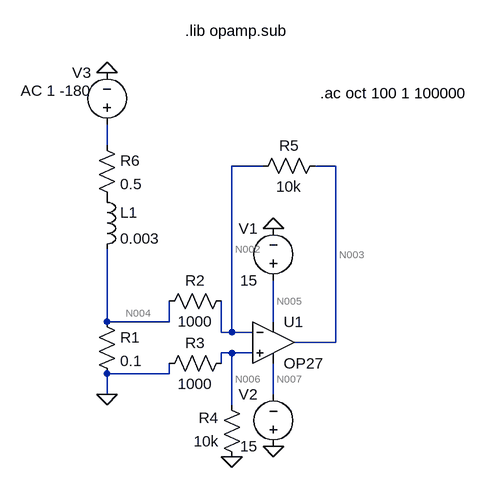
[diagram p0: schematic test_coil_bodecorrel.asc]
test_coil_bodecorrel.asc, the LTspice schematic file:
Version 4
SHEET 1 880 680
WIRE 128 -64 128 -96
WIRE 368 -32 320 -32
WIRE 480 -32 448 -32
WIRE 128 208 128 96
WIRE 224 208 224 176
WIRE 224 208 128 208
WIRE 384 208 384 144
WIRE 304 224 304 176
WIRE 320 224 320 -32
WIRE 320 224 304 224
WIRE 352 224 320 224
WIRE 480 240 480 -32
WIRE 480 240 416 240
WIRE 320 256 304 256
WIRE 352 256 320 256
WIRE 304 272 304 256
WIRE 224 288 224 272
WIRE 224 288 128 288
WIRE 128 320 128 288
WIRE 384 320 384 272
WIRE 320 336 320 256
FLAG 320 416 0
FLAG 128 320 0
FLAG 384 400 0
FLAG 384 64 0
FLAG 128 -176 0
SYMBOL OpAmps\\OP27 384 176 R0
SYMATTR InstName U1
SYMBOL res 112 192 R0
SYMATTR InstName R1
SYMATTR Value 0.1
SYMBOL res 320 160 R90
WINDOW 0 0 56 VBottom 2
WINDOW 3 32 56 VTop 2
SYMATTR InstName R2
SYMATTR Value 1000
SYMBOL res 320 256 R90
WINDOW 0 0 56 VBottom 2
WINDOW 3 32 56 VTop 2
SYMATTR InstName R3
SYMATTR Value 1000
SYMBOL res 336 432 R180
WINDOW 0 36 76 Left 2
WINDOW 3 36 40 Left 2
SYMATTR InstName R4
SYMATTR Value 10k
SYMBOL res 352 -16 R270
WINDOW 0 32 56 VTop 2
WINDOW 3 0 56 VBottom 2
SYMATTR InstName R5
SYMATTR Value 10k
SYMBOL voltage 384 160 R180
WINDOW 0 24 96 Left 2
WINDOW 3 24 16 Left 2
SYMATTR InstName V1
SYMATTR Value 15
SYMBOL voltage 384 416 R180
WINDOW 0 24 96 Left 2
WINDOW 3 24 16 Left 2
SYMATTR InstName V2
SYMATTR Value 15
SYMBOL ind 112 0 R0
SYMATTR InstName L1
SYMATTR Value 0.003
SYMBOL res 112 -80 R0
SYMATTR InstName R6
SYMATTR Value 0.5
SYMBOL voltage 128 -80 R180
WINDOW 0 24 96 Left 2
WINDOW 3 24 16 Left 2
WINDOW 123 24 68 Left 2
WINDOW 39 0 0 Left 0
SYMATTR InstName V3
SYMATTR Value ""
SYMATTR Value2 AC 1 -180
TEXT 248 -240 Left 2 !.lib opamp.sub
TEXT 456 -144 Left 2 !.ac oct 100 1 100000

The netlist it stands for:
* test_coil_bodecorrel.asc
XU1 N006 N002 N005 N007 N003 OP27  ; pins In+ In- V+ V- OUT
R1 N004 0 0.1
R2 N002 N004 1000
R3 N006 0 1000
R4 0 N006 10k
R5 N002 N003 10k
V1 N005 0 15
V2 0 N007 15
L1 P001 N004 0.003
R6 N001 P001 0.5
V3 N001 0 AC 1 -180
.lib opamp.sub
.ac oct 100 1 100000
.lib ADI.lib
.backanno
.end

* Results of the author's LTspice run, read from the files saved beside the schematic
* Operating Point, zero values left out:
*   V(n005) = 15 V
*   V(n007) = -15 V
*   I(V1) = -2.968 mA
*   I(V2) = -2.968 mA
*   Ix(u1:3) = 2.968 mA
*   Ix(u1:4) = -2.968 mA
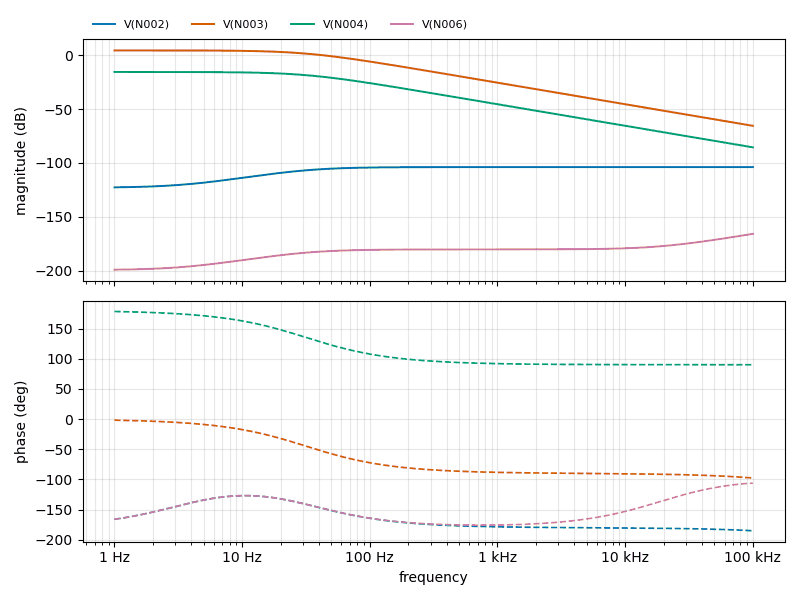
[diagram p1: AC Analysis of test_coil_bodecorrel.asc, plotted from the saved traces]
* AC Analysis, 1 run:
*   V(N002): -122.62 dB at 1 Hz, -103.83 dB at 100 kHz, peak -103.82 dB at 9.878 kHz, 3 dB below the peak at 31.49 Hz
*   V(N003): 4.42 dB at 1 Hz, -65.53 dB at 100 kHz, peak 4.42 dB at 1 Hz, 3 dB below the peak at 31.91 Hz
*   V(N004): -15.58 dB at 1 Hz, -85.51 dB at 100 kHz, peak -15.58 dB at 1 Hz, 3 dB below the peak at 31.91 Hz
*   V(N006): -199.01 dB at 1 Hz, -165.77 dB at 100 kHz, peak -165.77 dB at 100 kHz, 3 dB below the peak at 69.36 kHz